# Altium schematic sheet Caps.SchDoc
size A
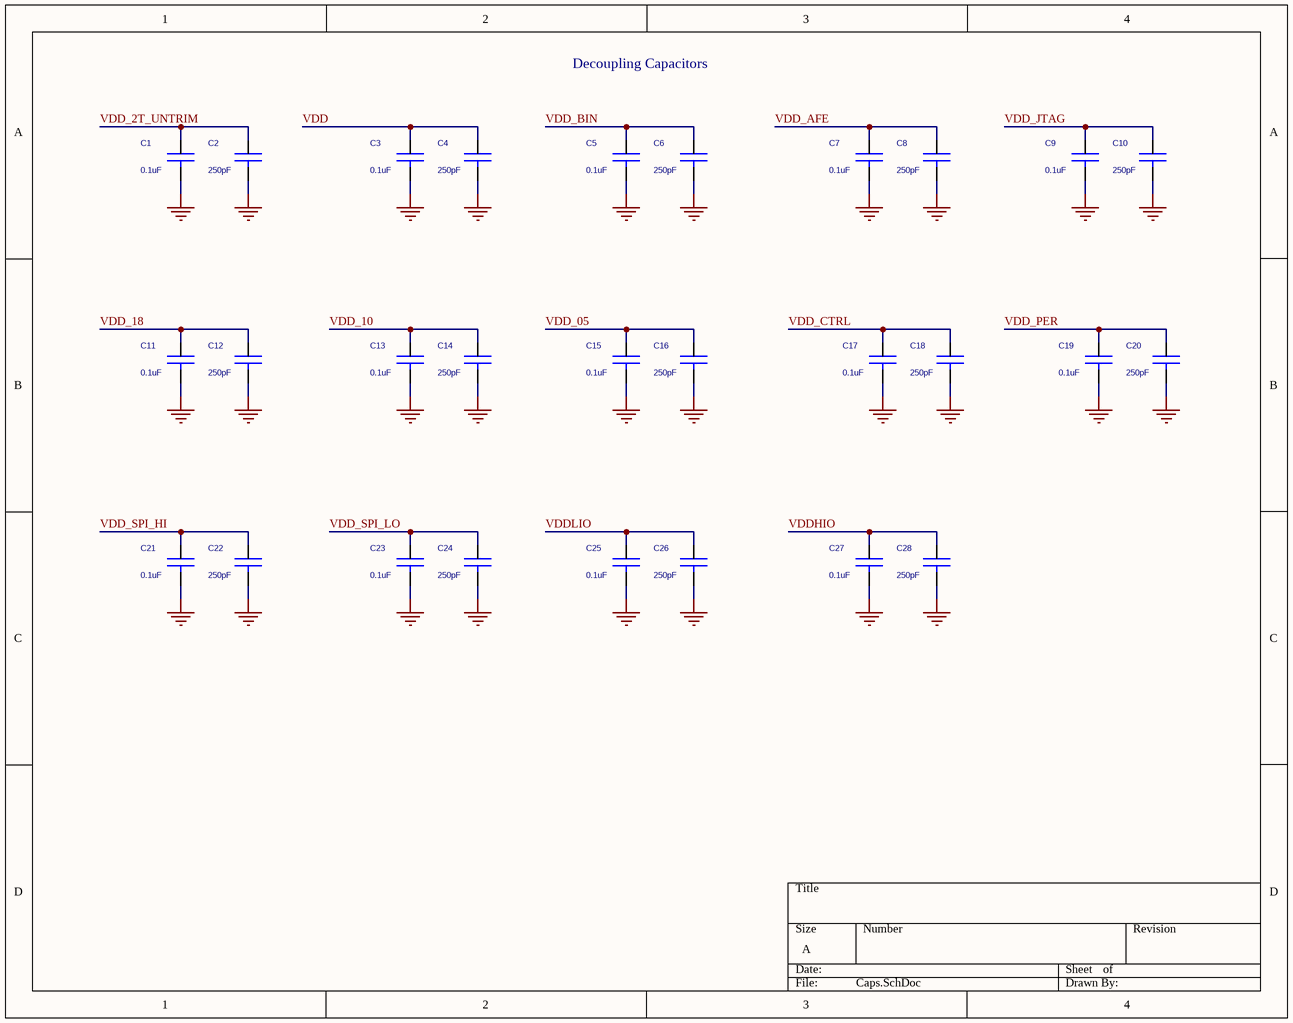
[diagram p0: Caps.SchDoc]

## Parts
C1  0.1uF  [0402]
C2  250pF  [0402]
C3  0.1uF  [0402]
C4  250pF  [0402]
C5  0.1uF  [0402]
C6  250pF  [0402]
C7  0.1uF  [0402]
C8  250pF  [0402]
C9  0.1uF  [0402]
C10  250pF  [0402]
C11  0.1uF  [0402]
C12  250pF  [0402]
C13  0.1uF  [0402]
C14  250pF  [0402]
C15  0.1uF  [0402]
C16  250pF  [0402]
C17  0.1uF  [0402]
C18  250pF  [0402]
C19  0.1uF  [0402]
C20  250pF  [0402]
C21  0.1uF  [0402]
C22  250pF  [0402]
C23  0.1uF  [0402]
C24  250pF  [0402]
C25  0.1uF  [0402]
C26  250pF  [0402]
C27  0.1uF  [0402]
C28  250pF  [0402]

## Nets
GND: C1.2 C2.2 C3.2 C4.2 C5.2 C6.2 C7.2 C8.2 C9.2 C10.2 C11.2 C12.2 C13.2 C14.2 C15.2 C16.2 C17.2 C18.2 C19.2 C20.2 C21.2 C22.2 C23.2 C24.2 C25.2 C26.2 C27.2 C28.2
VDD: C3.1 C4.1
VDD_2T_UNTRIM: C1.1 C2.1
VDD_05: C15.1 C16.1
VDD_10: C13.1 C14.1
VDD_18: C11.1 C12.1
VDD_AFE: C7.1 C8.1
VDD_BIN: C5.1 C6.1
VDD_CTRL: C17.1 C18.1
VDD_JTAG: C9.1 C10.1
VDD_PER: C19.1 C20.1
VDD_SPI_HI: C21.1 C22.1
VDD_SPI_LO: C23.1 C24.1
VDDHIO: C27.1 C28.1
VDDLIO: C25.1 C26.1

## Notes on the sheet
- Decoupling Capacitors

## Library data of the parts
C1-C28 = C